# Altium schematic sheet ACDC.SchDoc
size A4; SheetNumber: 7; SheetTotal: 7
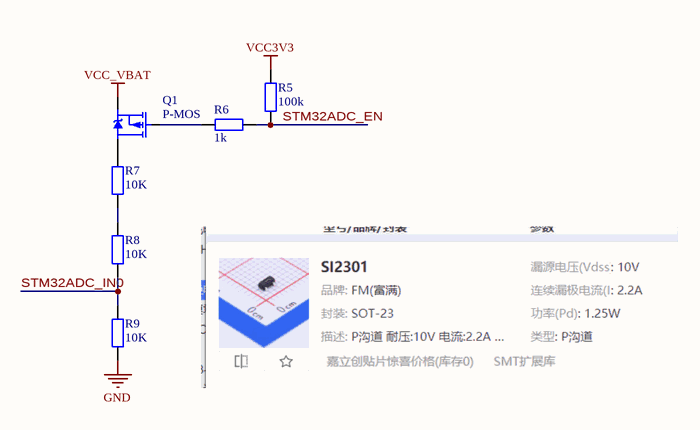
[diagram p0: ACDC.SchDoc]

## Parts
Q1  P-MOS  [SOT23]
R5  100k  [R 0805_L]
R6  1k  [R 0805_L]
R7  10K  [R 0805_L]
R8  10K  [R 0805_L]
R9  10K  [R 0805_L]

## Nets
GND: R9.1
VCC3V3: R5.2
VCC_VBAT: Q1.S
STM32ADC_EN: R5.1 R6.1
STM32ADC_IN0: R8.1 R9.2
NetQ1_D: Q1.D R7.2
NetQ1_G: Q1.G R6.2
NetR7_1: R7.1 R8.2

## Library data of the parts
Q1 = P-MOS: P沟道场效应管
R5 R6 = R_2: 贴片电阻; 版权归属: 源创客; BOM名称: 贴片电阻; 学习资源: www.ooocke.com
R7-R9 = R_3: 贴片电阻; 版权归属: 源创客; BOM名称: 贴片电阻; 学习资源: www.ooocke.com